# EAGLE schematic me433-hw6_p2 (EAGLE 9.6.2)
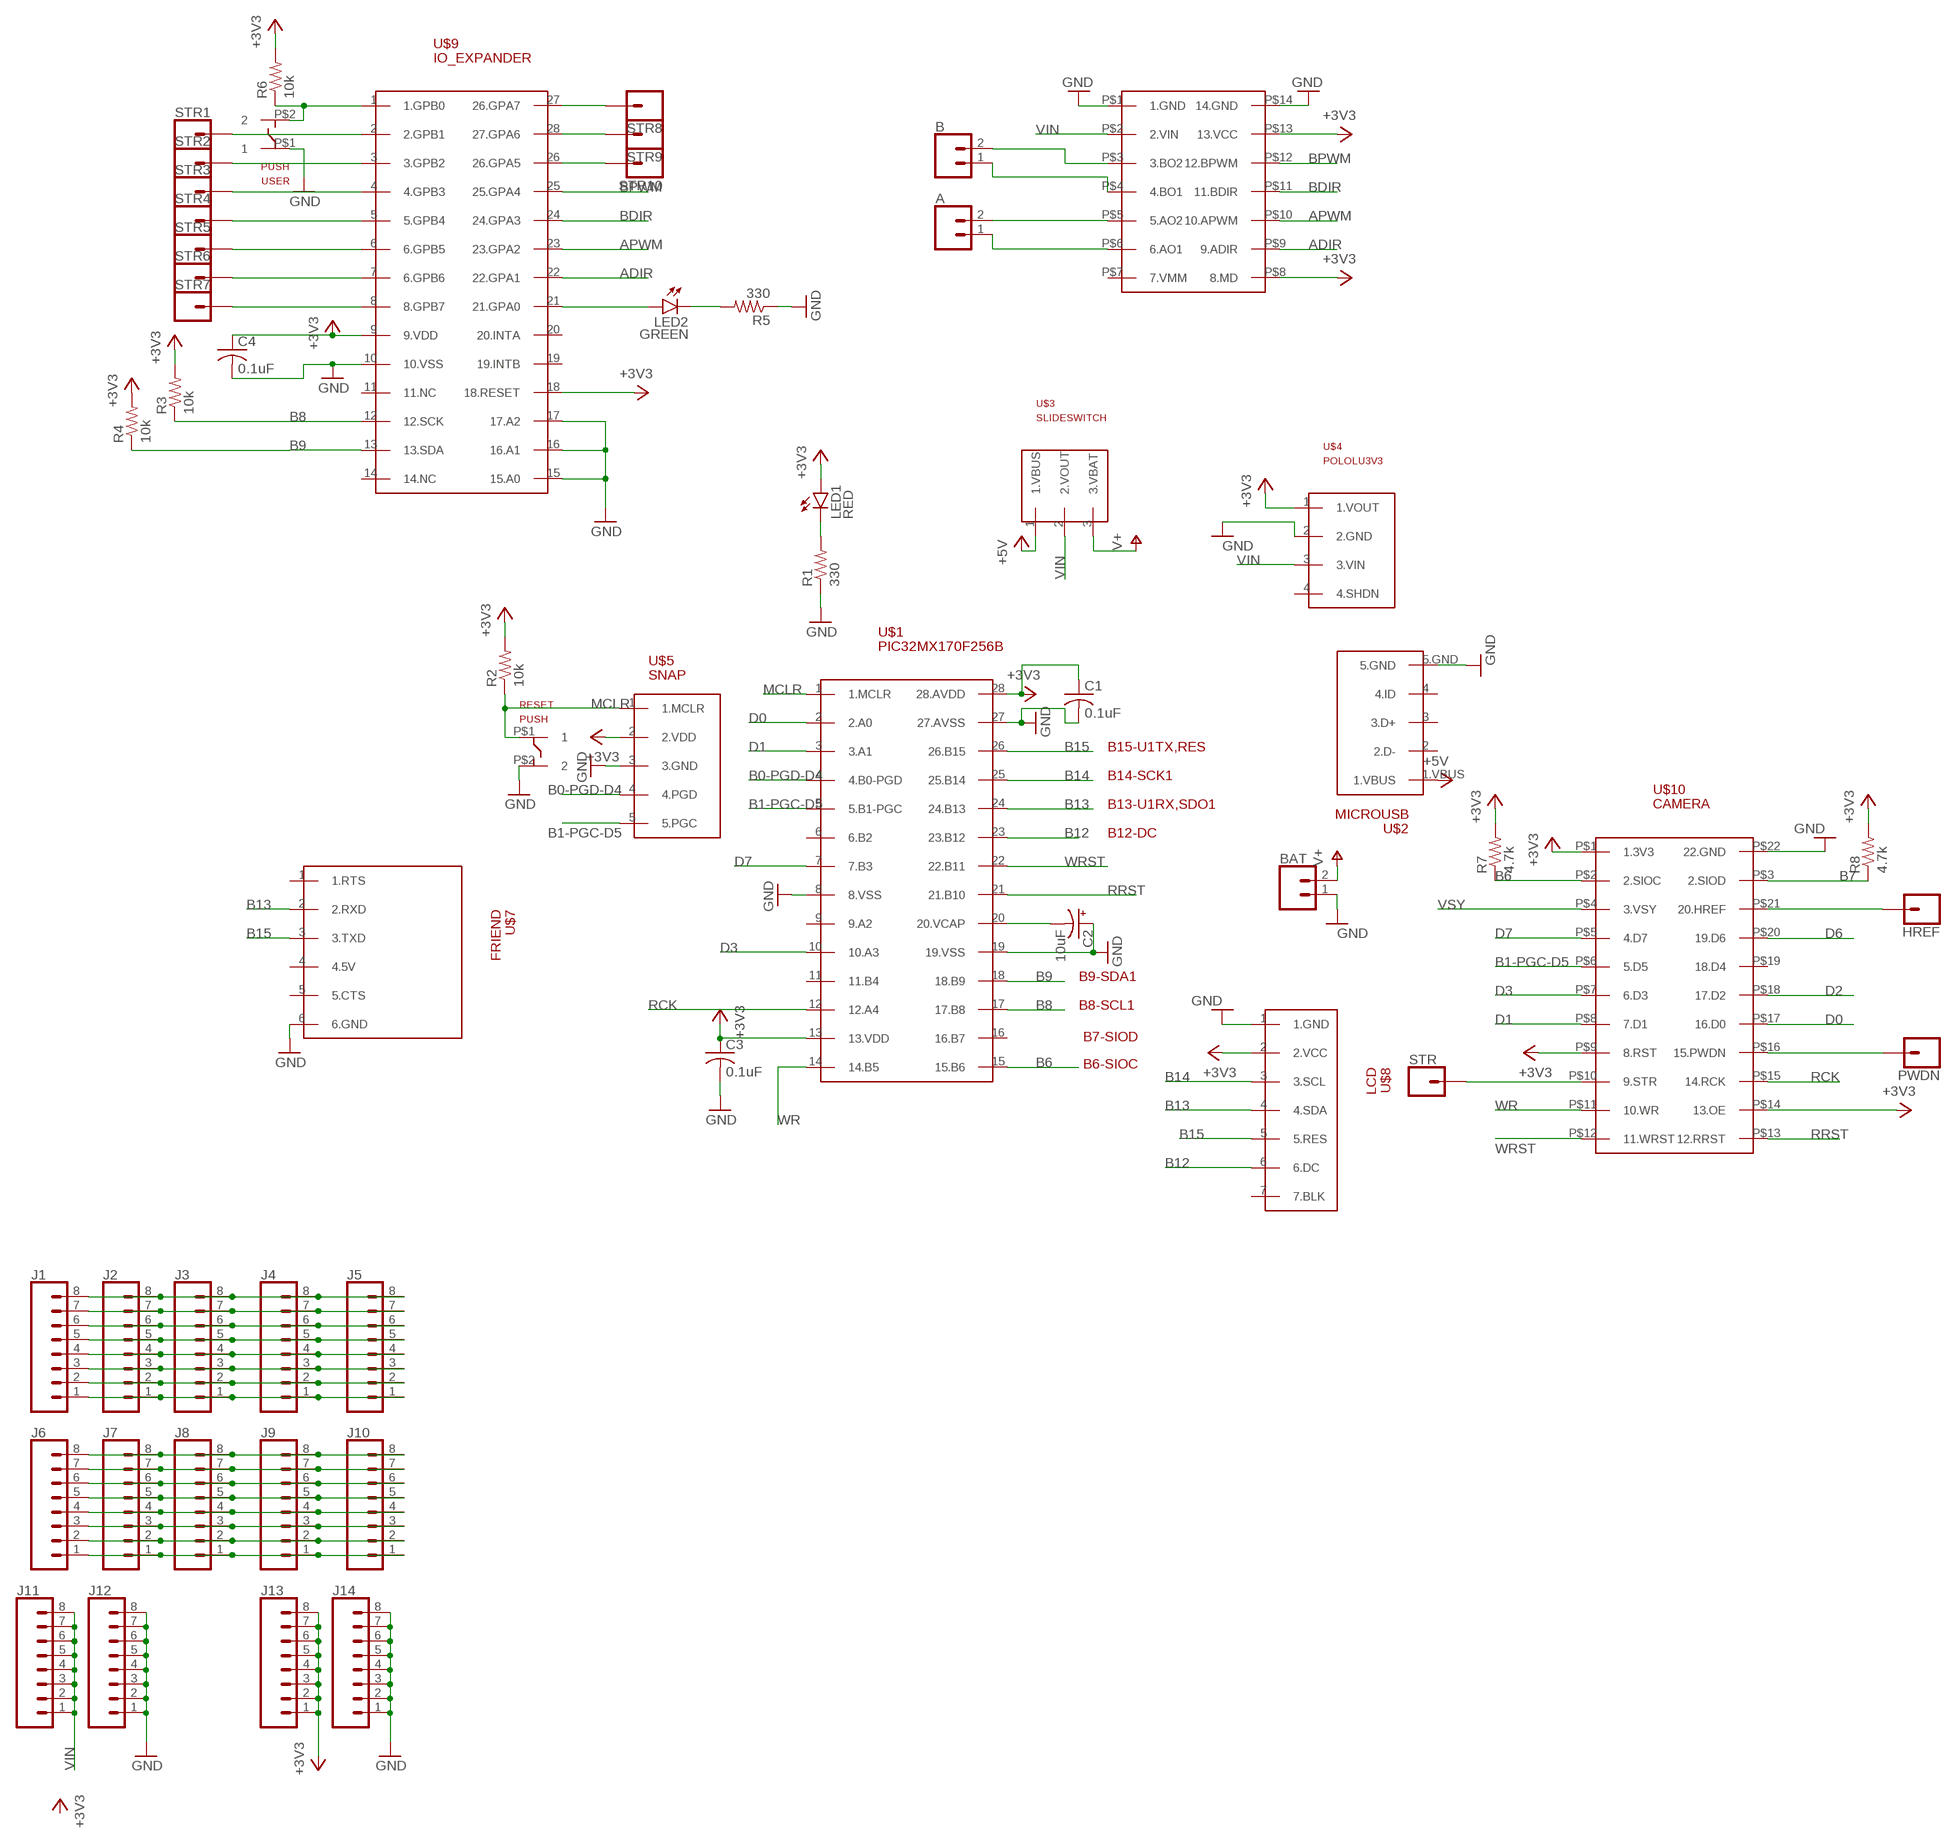
[diagram p0: schematic, sheet 1]

## Parts
A  CONN_02  [1X02]
B  CONN_02  [1X02]
BAT  CONN_02  [1X02]
C1  0.1uF  C-US025-030X050  [C025-030X050]
C2  10uF  CPOL-USB45181B  [B45181B]
C3  0.1uF  C-US025-030X050  [C025-030X050]
C4  0.1uF  C-US025-030X050  [C025-030X050]
HREF  CONN_01  [1X01]
J1  CONN_08"  [1X08]
J2  CONN_08"  [1X08]
J3  CONN_08"  [1X08]
J4  CONN_08"  [1X08]
J5  CONN_08"  [1X08]
J6  CONN_08"  [1X08]
J7  CONN_08"  [1X08]
J8  CONN_08"  [1X08]
J9  CONN_08"  [1X08]
J10  CONN_08"  [1X08]
J11  CONN_08"  [1X08]
J12  CONN_08"  [1X08]
J13  CONN_08"  [1X08]
J14  CONN_08"  [1X08]
LED1  RED  LED3MM  [LED3MM]
LED2  GREEN  LED3MM  [LED3MM]
PWDN  CONN_01  [1X01]
R1  330  R-US_0207/10  [0207/10]
R2  10k  R-US_0207/10  [0207/10]
R3  10k  R-US_0207/10  [0207/10]
R4  10k  R-US_0207/10  [0207/10]
R5  330  R-US_0207/10  [0207/10]
R6  10k  R-US_0207/10  [0207/10]
R7  4.7k  R-US_0207/10  [0207/10]
R8  4.7k  R-US_0207/10  [0207/10]
RESET  PUSH  [PUSH]
STR  CONN_01  [1X01]
STR1  CONN_01  [1X01]
STR2  CONN_01  [1X01]
STR3  CONN_01  [1X01]
STR4  CONN_01  [1X01]
STR5  CONN_01  [1X01]
STR6  CONN_01  [1X01]
STR7  CONN_01  [1X01]
STR8  CONN_01  [1X01]
STR9  CONN_01  [1X01]
STR10  CONN_01  [1X01]
U$1  PIC32MX170F256B  [DIL28-3]
U$2  MICROUSB  [MICROUSB]
U$3  SLIDESWITCH  [SLIDESWITCH]
U$4  POLOLU3V3  [POLULO3V3]
U$5  SNAP  [1X05]
U$6  H-BRIDGE  [H-BRIDGE]
U$7  FRIEND  [FRIEND]
U$8  LCD  [LCD]
U$9  IO_EXPANDER  [DIL28-3]
U$10  CAMERA  [CAMERA]
USER  PUSH  [PUSH]

## Nets
+3V3: C1.1 C4.1 J13.1 J13.2 J13.3 J13.4 J13.5 J13.6 J13.7 J13.8 LED1.A R2.2 R3.2 R4.2 R6.2 R7.2 R8.2 U$1.28(28.AVDD) U$4.1(1.VOUT) U$5.2(2.VDD) U$6.P$8(8.MD) U$6.P$13(13.VCC) U$8.2(2.VCC) U$9.9(9.VDD) U$9.18(18.RESET) U$10.P$1(1.3V3) U$10.P$9(8.RST) U$10.P$14(13.OE)
+5V: U$2.1.VBUS U$3.1(1.VBUS)
ADIR: U$6.P$9(9.ADIR) U$9.22(22.GPA1)
APWM: U$6.P$10(10.APWM) U$9.23(23.GPA2)
B0-PGD-D4: U$1.4(4.B0-PGD) U$5.4(4.PGD)
B1-PGC-D5: U$1.5(5.B1-PGC) U$5.5(5.PGC) U$10.P$6(5.D5)
B6: R7.1 U$1.15(15.B6) U$10.P$2(2.SIOC)
B7: R8.1 U$10.P$3(2.SIOD)
B8: R3.1 U$1.17(17.B8) U$9.12(12.SCK)
B9: R4.1 U$1.18(18.B9) U$9.13(13.SDA)
B12: U$1.23(23.B12) U$8.6(6.DC)
B13: U$1.24(24.B13) U$7.2(2.RXD) U$8.4(4.SDA)
B14: U$1.25(25.B14) U$8.3(3.SCL)
B15: U$1.26(26.B15) U$7.3(3.TXD) U$8.5(5.RES)
BDIR: U$6.P$11(11.BDIR) U$9.24(24.GPA3)
BPWM: U$6.P$12(12.BPWM) U$9.25(25.GPA4)
D0: U$1.2(2.A0) U$10.P$17(16.D0)
D1: U$1.3(3.A1) U$10.P$8(7.D1)
D2: U$10.P$18(17.D2)
D3: U$1.10(10.A3) U$10.P$7(6.D3)
D6: U$10.P$20(19.D6)
D7: U$1.7(7.B3) U$10.P$5(4.D7)
GND: BAT.1 C1.2 C2.+ C3.2 C4.2 J12.1 J12.2 J12.3 J12.4 J12.5 J12.6 J12.7 J12.8 J14.1 J14.2 J14.3 J14.4 J14.5 J14.6 J14.7 J14.8 R1.1 R5.1 RESET.P$2 U$1.8(8.VSS) U$1.19(19.VSS) U$1.27(27.AVSS) U$2.5.GND U$4.2(2.GND) U$5.3(3.GND) U$6.P$1(1.GND) U$7.6(6.GND) U$8.1(1.GND) U$9.10(10.VSS) U$9.15(15.A0) U$9.16(16.A1) U$9.17(17.A2) U$10.P$22(22.GND) USER.P$1
MCLR: R2.1 RESET.P$1 U$1.1(1.MCLR) U$5.1(1.MCLR)
N$2: LED1.K(C) R1.2
N$3: C2.- U$1.20(20.VCAP)
N$4: C3.1 U$1.13(13.VDD) ; supply symbol labelled +3V3
N$5: LED2.A U$9.21(21.GPA0)
N$6: R6.1 U$9.1(1.GPB0) USER.P$2
N$7: LED2.K(C) R5.2
N$8: U$6.P$14(14.GND) ; supply symbol labelled GND
N$9: B.2 U$6.P$3(3.BO2)
N$10: B.1 U$6.P$4(4.BO1)
N$11: A.2 U$6.P$5(5.AO2)
N$12: A.1 U$6.P$6(6.AO1)
N$13: STR.1 U$10.P$10(9.STR)
N$14: PWDN.1 U$10.P$16(15.PWDN)
N$15: HREF.1 U$10.P$21(20.HREF)
N$16: STR8.1 U$9.27(26.GPA7)
N$17: STR9.1 U$9.28(27.GPA6)
N$18: STR10.1 U$9.26(26.GPA5)
N$19: STR1.1 U$9.2(2.GPB1)
N$20: STR2.1 U$9.3(3.GPB2)
N$21: STR3.1 U$9.4(4.GPB3)
N$22: STR4.1 U$9.5(5.GPB4)
N$23: STR5.1 U$9.6(6.GPB5)
N$24: STR6.1 U$9.7(6.GPB6)
N$25: STR7.1 U$9.8(8.GPB7)
N$26: J1.8 J2.8 J3.8 J4.8 J5.8
N$27: J1.7 J2.7 J3.7 J4.7 J5.7
N$28: J1.6 J2.6 J3.6 J4.6 J5.6
N$29: J1.5 J2.5 J3.5 J4.5 J5.5
N$30: J1.4 J2.4 J3.4 J4.4 J5.4
N$31: J1.3 J2.3 J3.3 J4.3 J5.3
N$32: J1.2 J2.2 J3.2 J4.2 J5.2
N$33: J1.1 J2.1 J3.1 J4.1 J5.1
N$34: J6.8 J7.8 J8.8 J9.8 J10.8
N$35: J6.7 J7.7 J8.7 J9.7 J10.7
N$36: J6.6 J7.6 J8.6 J9.6 J10.6
N$37: J6.5 J7.5 J8.5 J9.5 J10.5
N$38: J6.4 J7.4 J8.4 J9.4 J10.4
N$39: J6.3 J7.3 J8.3 J9.3 J10.3
N$40: J6.2 J7.2 J8.2 J9.2 J10.2
N$41: J6.1 J7.1 J8.1 J9.1 J10.1
RCK: U$1.12(12.A4) U$10.P$15(14.RCK)
RRST: U$1.21(21.B10) U$10.P$13(12.RRST)
V+: BAT.2 U$3.3(3.VBAT)
VIN: J11.1 J11.2 J11.3 J11.4 J11.5 J11.6 J11.7 J11.8 U$3.2(2.VOUT) U$4.3(3.VIN) U$6.P$2(2.VIN)
VSY: U$10.P$4(3.VSY)
WR: U$1.14(14.B5) U$10.P$11(10.WR)
WRST: U$1.22(22.B11) U$10.P$12(11.WRST)
Unconnected: U$1.6(6.B2) U$1.9(9.A2) U$1.11(11.B4) U$1.16(16.B7) U$2.2(2.D-) U$2.3(3.D+) U$2.4(4.ID) U$4.4(4.SHDN) U$6.P$7(7.VMM) U$7.1(1.RTS) U$7.4(4.5V) U$7.5(5.CTS) U$8.7(7.BLK) U$9.11(11.NC) U$9.14(14.NC) U$9.19(19.INTB) U$9.20(20.INTA) U$10.P$19(18.D4)

## Notes on the sheet
- B15-U1TX,RES
- B14-SCK1
- B13-U1RX,SDO1
- B12-DC
- B9-SDA1
- B8-SCL1
- B7-SIOD
- B6-SIOC

## Library data of the parts
A B BAT = hw6_lib:CONN_02: Multi connection point. Often used as Generic Header-pin footprint for 0.1 inch spaced/style header connections On any of the 0.1 inch spaced packages, you can populate with these: Break Away Headers - Straight <https://www.sparkfun.com/products/116> (PRT-00116) Break Away Male Headers - Right Angle <https://www.sparkfun.com/products/553> (PRT-00553) Female Headers <https://www.sparkfun.com/products/115> (PRT-00115) Break Away Headers - Machine Pin <https://www.sparkfun.com/products/117> (PRT-00117) Break Away Female Headers - Swiss Machine Pin <https://www.sparkfun.com/products/743> (PRT-00743) For SCREWTERMINALS and SPRING TERMINALS visit here: Screw Terimnals on SparkFun.com <https://www.sparkfun.com/search/results?term=Screw+Terminals> (5mm/3.5mm/2.54mm spacing) This device is also useful as a general connection point to wire up your design to another part of your project. Our various solder wires solder well into these plated through hole pads. Hook-Up Wire - Assortment (Stranded, 22 AWG) <https://www.sparkfun.com/products/11375> (PRT-11375) Hook-Up Wire - Assortment (Solid Core, 22 AWG) <https://www.sparkfun.com/products/11367> (PRT-11367) View the entire wire category on our website here <https://www.sparkfun.com/categories/141> Special notes: Molex polarized connector foot print use with: PRT-08233 with associated crimp pins and housings. 2.54_SCREWTERM for use with PRT-10571. 3.5mm Screw Terminal footprints for PRT-08084 5mm Screw Terminal footprints for use with PRT-08432
C1 C3 C4 = hw6_lib:C-US: CAPACITOR, American symbol; SPICEPREFIX: C
C2 = hw6_lib:CPOL-US: POLARIZED CAPACITOR, American symbol; SPICEPREFIX: C
HREF PWDN STR STR1-STR10 = hw6_lib:CONN_01: Single connection point. Often used as Generic Header-pin footprint for 0.1 inch spaced/style header connections On any of the 0.1 inch spaced packages, you can populate with these: Break Away Headers - Straight <https://www.sparkfun.com/products/116> (PRT-00116) Break Away Male Headers - Right Angle <https://www.sparkfun.com/products/553> (PRT-00553) Female Headers <https://www.sparkfun.com/products/115> (PRT-00115) Break Away Headers - Machine Pin <https://www.sparkfun.com/products/117> (PRT-00117) Break Away Female Headers - Swiss Machine Pin <https://www.sparkfun.com/products/743> (PRT-00743) This device is also useful as a general connection point to wire up your design to another part of your project. Our various solder wires solder well into these plated through hole pads. Hook-Up Wire - Assortment (Stranded, 22 AWG) <https://www.sparkfun.com/products/11375> (PRT-11375) Hook-Up Wire - Assortment (Solid Core, 22 AWG) <https://www.sparkfun.com/products/11367> (PRT-11367) View the entire wire category on our website here <https://www.sparkfun.com/categories/141> Special notes: SMTSO-256-ET is a "flush mount" nut for a 4-40 screw. We mostly use this on specialty testbeds; it is a nice way to connect hardware to your PCB at an adjustable hieght. Also note, the SNAP packages are for using a snappable style connector. We sell a baggie of snaps and they are also used on two LilyPad designs: Snap Assortment - 30 pack (male and female) <https://www.sparkfun.com/products/11347> (DEV-11347) LilyPad Arduino SimpleSnap <https://www.sparkfun.com/products/10941> (DEV-10941) LilyPad SimpleSnap Protoboard <https://www.sparkfun.com/products/10940> (DEV-10940)
J1-J14 = hw6_lib:CONN_08: Multi connection point. Often used as Generic Header-pin footprint for 0.1 inch spaced/style header connections On any of the 0.1 inch spaced packages, you can populate with these: Break Away Headers - Straight <https://www.sparkfun.com/products/116> (PRT-00116) Break Away Male Headers - Right Angle <https://www.sparkfun.com/products/553> (PRT-00553) Female Headers <https://www.sparkfun.com/products/115> (PRT-00115) Break Away Headers - Machine Pin <https://www.sparkfun.com/products/117> (PRT-00117) Break Away Female Headers - Swiss Machine Pin <https://www.sparkfun.com/products/743> (PRT-00743) Arduino Stackable Header - 8 Pin <https://www.sparkfun.com/products/9279> (PRT-09279) For SCREWTERMINALS and SPRING TERMINALS visit here: Screw Terimnals on SparkFun.com <https://www.sparkfun.com/search/results?term=Screw+Terminals> (5mm/3.5mm/2.54mm spacing) This device is also useful as a general connection point to wire up your design to another part of your project. Our various solder wires solder well into these plated through hole pads. Hook-Up Wire - Assortment (Stranded, 22 AWG) <https://www.sparkfun.com/products/11375> (PRT-11375) Hook-Up Wire - Assortment (Solid Core, 22 AWG) <https://www.sparkfun.com/products/11367> (PRT-11367) View the entire wire category on our website here <https://www.sparkfun.com/categories/141> Special notes: Molex polarized connector foot print use with SKU : PRT-08231 with associated crimp pins and housings. 1MM SMD Version SKU: PRT-10208 NOTES ON THE VARIANTS LOCK and LOCK_LONGPADS... This footprint was designed to help hold the alignment of a through-hole component (i.e. 6-pin header) while soldering it into place. You may notice that each hole has been shifted either up or down by 0.005 of an inch from it's more standard position (which is a perfectly straight line). This slight alteration caused the pins (the squares in the middle) to touch the edges of the holes. Because they are alternating, it causes a "brace" to hold the component in place. 0.005 has proven to be the perfect amount of "off-center" position when using our standard breakaway headers. Although looks a little odd when you look at the bare footprint, once you have a header in there, the alteration is very hard to notice. Also,if you push a header all the way into place, it is covered up entirely on the bottom side.; PROD_ID: CONN-08438
LED1 LED2 = hw6_lib:LED: LED OSRAM: - CHIPLED LG R971, LG N971, LY N971, LG Q971, LY Q971, LO R971, LY R971 LH N974, LH R974 LS Q976, LO Q976, LY Q976 LO Q996 - Hyper CHIPLED LW Q18S LB Q993, LB Q99A, LB R99A - SideLED LS A670, LO A670, LY A670, LG A670, LP A670 LB A673, LV A673, LT A673, LW A673 LH A674 LY A675 LS A676, LA A676, LO A676, LY A676, LW A676 LS A679, LY A679, LG A679 - Hyper Micro SIDELED® LS Y876, LA Y876, LO Y876, LY Y876 LT Y87S - SmartLED LW L88C, LW L88S LB L89C, LB L89S, LG L890 LS L89K, LO L89K, LY L89K LS L896, LA L896, LO L896, LY L896 - TOPLED LS T670, LO T670, LY T670, LG T670, LP T670 LSG T670, LSP T670, LSY T670, LOP T670, LYG T670 LG T671, LOG T671, LSG T671 LB T673, LV T673, LT T673, LW T673 LH T674 LS T676, LA T676, LO T676, LY T676, LB T676, LH T676, LSB T676, LW T676 LB T67C, LV T67C, LT T67C, LS T67K, LO T67K, LY T67K, LW E67C LS E67B, LA E67B, LO E67B, LY E67B, LB E67C, LV E67C, LT E67C LW T67C LS T679, LY T679, LG T679 LS T770, LO T770, LY T770, LG T770, LP T770 LB T773, LV T773, LT T773, LW T773 LH T774 LS E675, LA E675, LY E675, LS T675 LS T776, LA T776, LO T776, LY T776, LB T776 LHGB T686 LT T68C, LB T68C - Hyper Mini TOPLED® LB M676 - Mini TOPLED Santana® LG M470 LS M47K, LO M47K, LY M47K Source: http://www.osram.convergy.de LUXEON: - LUMILED® LXK2-PW12-R00, LXK2-PW12-S00, LXK2-PW14-U00, LXK2-PW14-V00 LXK2-PM12-R00, LXK2-PM12-S00, LXK2-PM14-U00 LXK2-PE12-Q00, LXK2-PE12-R00, LXK2-PE12-S00, LXK2-PE14-T00, LXK2-PE14-U00 LXK2-PB12-K00, LXK2-PB12-L00, LXK2-PB12-M00, LXK2-PB14-N00, LXK2-PB14-P00, LXK2-PB14-Q00 LXK2-PR12-L00, LXK2-PR12-M00, LXK2-PR14-Q00, LXK2-PR14-R00 LXK2-PD12-Q00, LXK2-PD12-R00, LXK2-PD12-S00 LXK2-PH12-R00, LXK2-PH12-S00 LXK2-PL12-P00, LXK2-PL12-Q00, LXK2-PL12-R00 Source: www.luxeon.com KINGBRIGHT: KA-3528ASYC Source: www.kingbright.com
R1-R8 = hw6_lib:R-US_: RESISTOR, American symbol; SPICEPREFIX: R
RESET USER = hw6_lib:PUSH
U$1 = hw6_lib:PIC32MX170F256B
U$2 = hw6_lib:MICROUSB
U$3 = hw6_lib:SLIDESWITCH
U$4 = hw6_lib:POLOLU3V3
U$5 = hw6_lib:SNAP
U$6 = hw6_lib:H-BRIDGE
U$7 = hw6_lib:FRIEND
U$8 = hw6_lib:LCD
U$9 = hw6_lib:IO_EXPANDER
U$10 = hw6_lib:CAMERA